# EAGLE design Stacja_Lutownicza_STM (EAGLE 9.2.2)
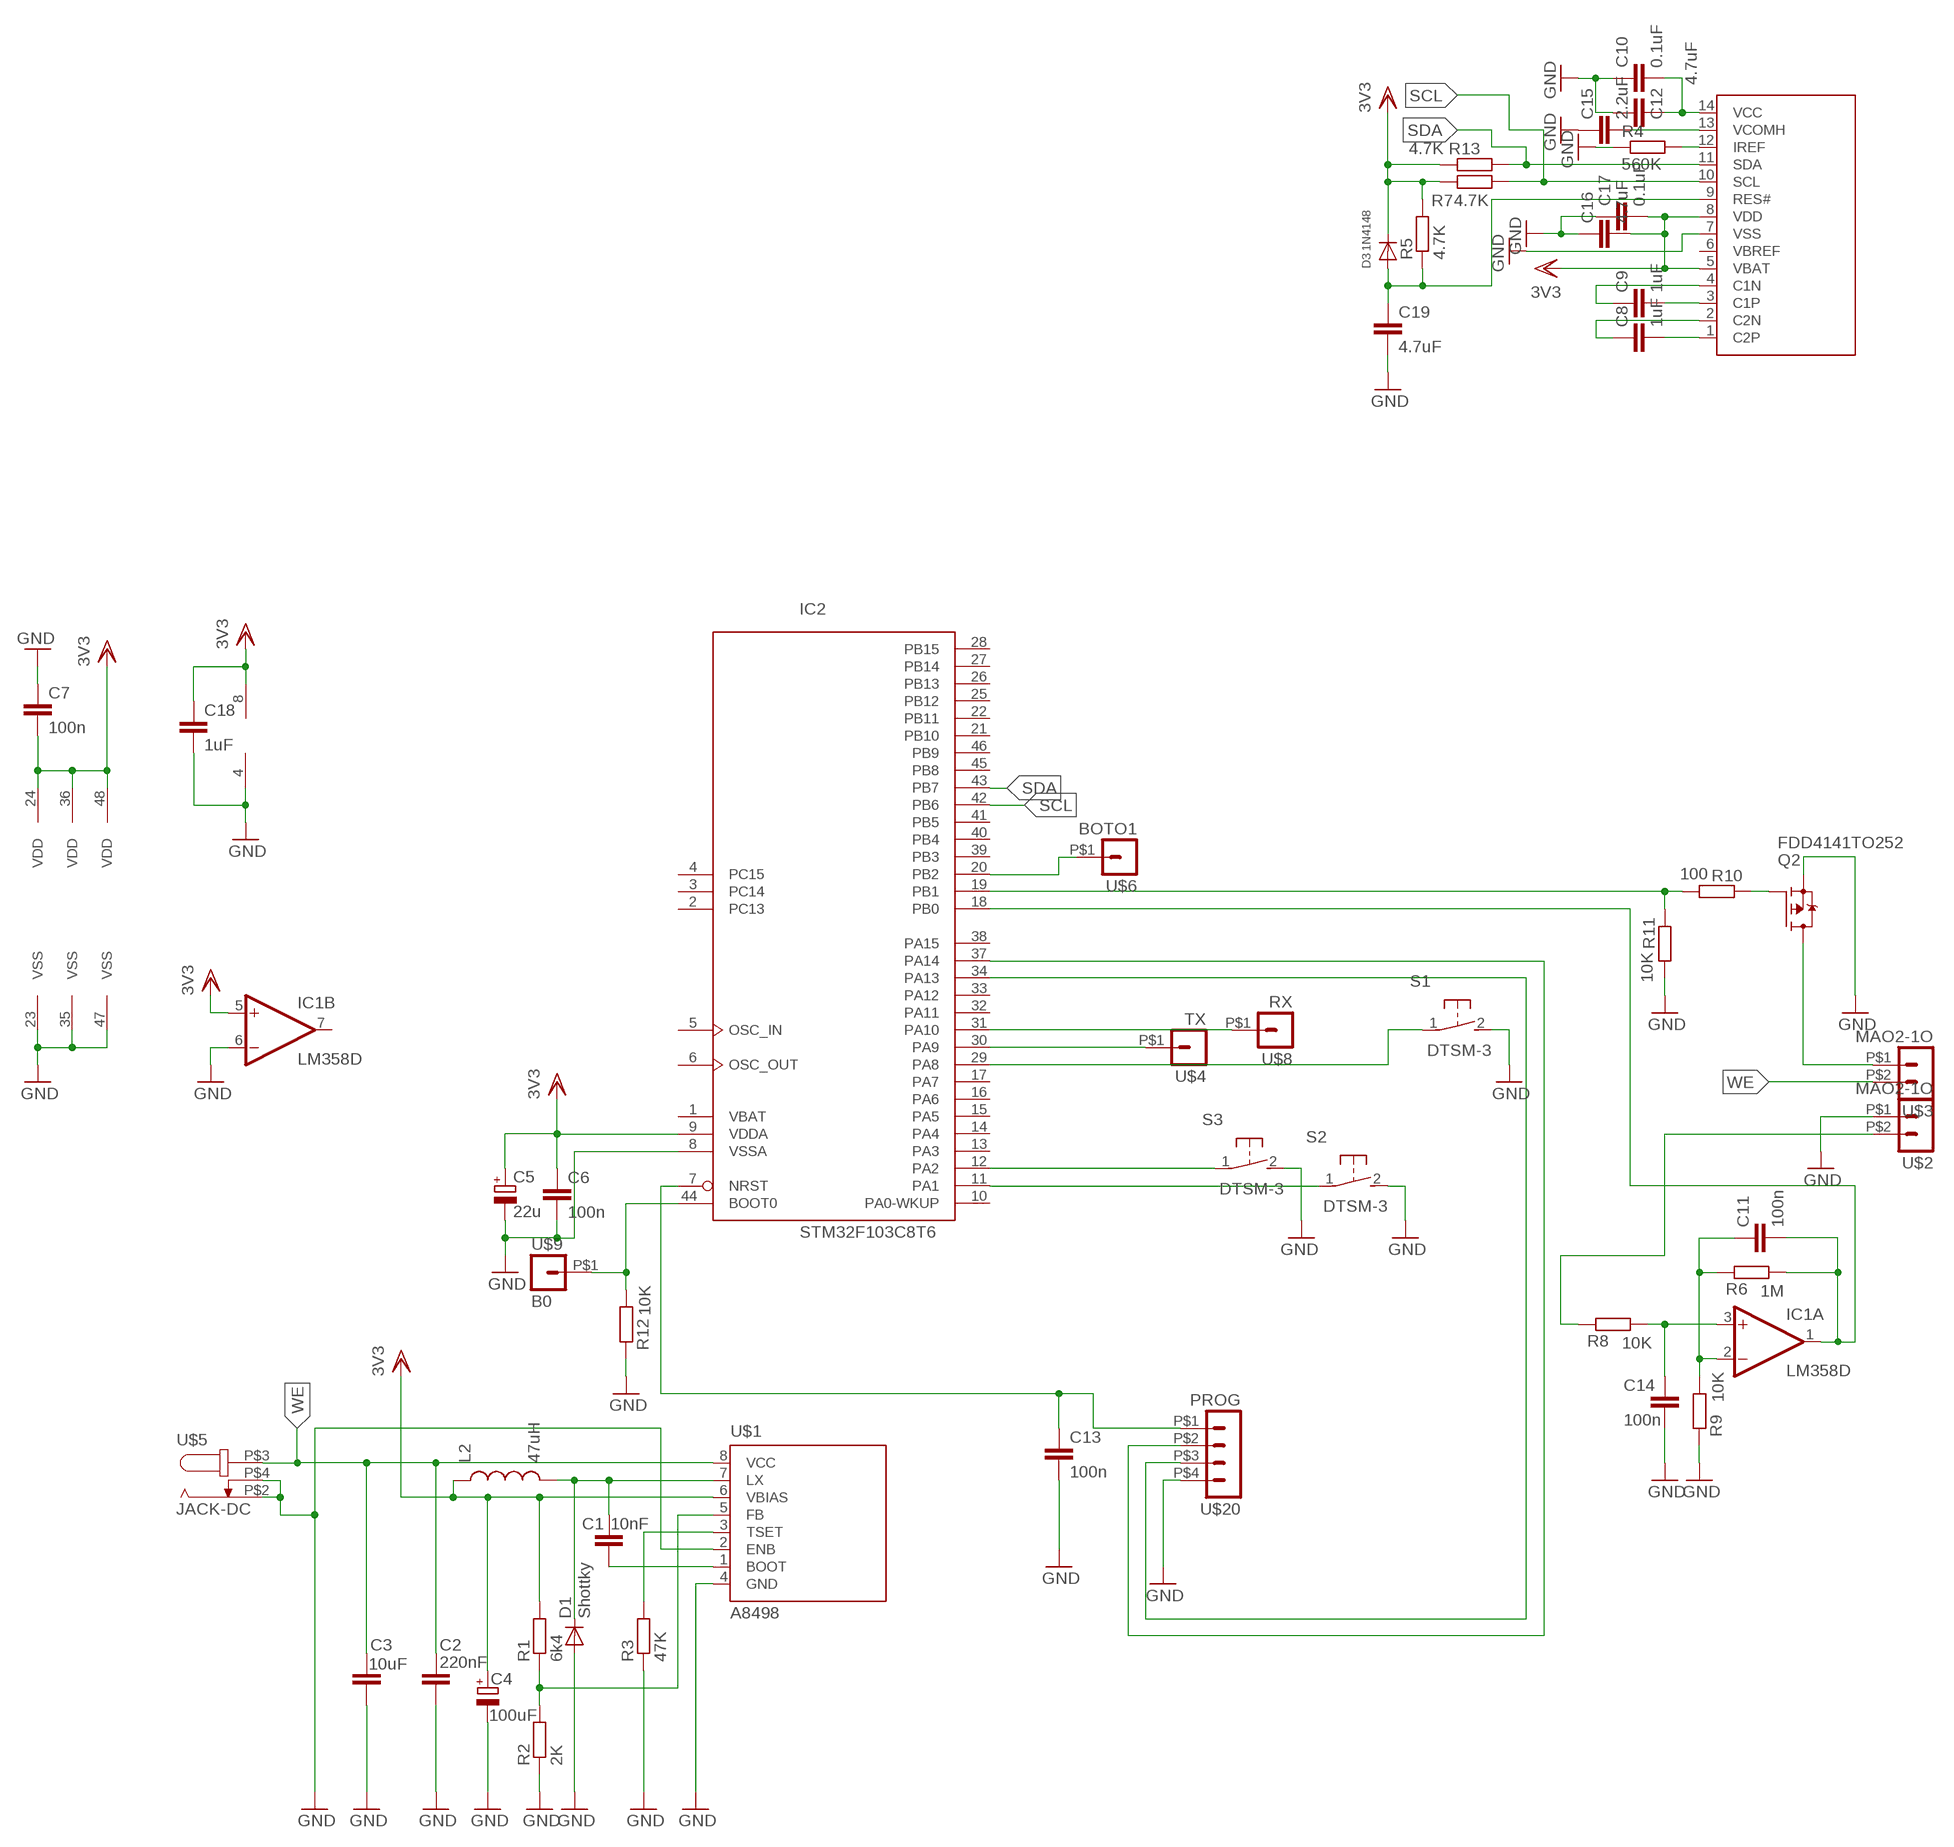
[diagram p0: schematic, sheet 1]

## Parts
C1  10nF  C-EUC1206  [C1206]
C2  220nF  C-EUC1210  [C1210]
C3  10uF  C-EUC0603  [C0603]
C4  100uF  CPOL-EUSMCD  [SMC_D]
C5  22u  CPOL-EUR/2012-12R  [R/2012-12R]
C6  100n  C-EUC0603  [C0603]
C7  100n  C-EUC0603  [C0603]
C8  1uF  C-EUC0603  [C0603]
C9  1uF  C-EUC0603  [C0603]
C10  0.1uF  C-EUC0603  [C0603]
C11  100n  C-EUC0603  [C0603]
C12  4.7uF  C-EUC0603  [C0603]
C13  100n  C-EUC0603  [C0603]
C14  100n  C-EUC0603  [C0603]
C15  2.2uF  C-EUC0603  [C0603]
C16  4.7uF  C-EUC0603  [C0603]
C17  0.1uF  C-EUC0603  [C0603]
C18  1uF  C-EUC0603  [C0603]
C19  4.7uF  C-EUC0603  [C0603]
D1  Shottky  CGRM4003-G  [SOD-123_MINI-SMA]
D3  1N4148  DIODESOD-323F  [SOD-323F]
IC1  LM358D  [SO08]
IC2  STM32F103C8T6  STM32F102C4T  [LQFP48]
L2  47uH  INDUCTOR1206H*  [INDUCTOR-1206]
Q2  FDD4141TO252  [TO252]
R1  6k4  R-EU_R0603  [R0603]
R2  2K  R-EU_R0603  [R0603]
R3  47K  R-EU_R0603  [R0603]
R4  560K  R-EU_R0603  [R0603]
R5  4.7K  R-EU_R0603  [R0603]
R6  1M  R-EU_R0603  [R0603]
R7  4.7K  R-EU_R0603  [R0603]
R8  10K  R-EU_R0603  [R0603]
R9  10K  R-EU_R0603  [R0603]
R10  100  R-EU_R0603  [R0603]
R11  10K  R-EU_R0603  [R0603]
R12  10K  R-EU_R0603  [R0603]
R13  4.7K  R-EU_R0603  [R0603]
S1  DTSM-3  [DTSM-3]
S2  DTSM-3  [DTSM-3]
S3  DTSM-3  [DTSM-3]
U$1  A8498  [SO08]
U$2  MAO2-1O  [MAO2-1O]
U$3  MAO2-1O  [MAO2-1O]
U$4  TX  MAO1-1O  [MAO1-1O]
U$5  JACK-DC  [JACK-DC]
U$6  BOTO1  MAO1-1O  [MAO1-1O]
U$7  OLED_0_91  [OLED_0_91]
U$8  RX  MAO1-1O  [MAO1-1O]
U$9  B0  MAO1-1O  [MAO1-1O]
U$20  PROG  MAO4-$O  [MAO4-4O]

## Nets
GND: C2.2 C3.2 C4.- C5.- C6.2 C7.1 C10.1 C12.1 C13.2 C14.2 C15.1 C16.1 C17.1 C18.2 C19.2 D1.A IC1.4(P:V-) IC1.6(B:-IN) IC2.8(VSSA) IC2.23(VSS) IC2.35(VSS) IC2.47(VSS) Q2.2(S) R2.1 R3.1 R4.1 R9.1 R11.2 R12.1 S1.2 S2.2 S3.2 U$1.2(ENB) U$1.4(GND) U$2.P$1 U$5.P$2 U$5.P$4 U$7.7(VSS) U$20.P$4
N$1: C1.2 D1.C L2.P$2 U$1.7(LX)
N$2: IC2.12(PA2) S3.1
N$3: IC2.29(PA8) S1.1
N$4: C1.1 U$1.1(BOOT)
N$5: IC2.30(PA9) U$4.P$1
N$6: R3.2 U$1.3(TSET)
N$7: R1.1 R2.2 U$1.5(FB)
N$8: IC2.31(PA10) U$8.P$1
N$9: IC2.11(PA1) S2.1
N$10: C11.2 IC1.1(A:OUT) IC2.18(PB0) R6.2
N$11: IC2.44(BOOT0) R12.2 U$9.P$1
N$12: C11.1 IC1.2(A:-IN) R6.1 R9.2
N$13: C14.1 IC1.3(A:+IN) R8.2
N$14: IC2.20(PB2) U$6.P$1
N$16: C8.2 U$7.1(C2P)
N$17: C8.1 U$7.2(C2N)
N$18: C9.2 U$7.3(C1P)
N$19: C9.1 U$7.4(C1N)
N$20: IC2.37(PA14) U$20.P$2
N$21: IC2.34(PA13) U$20.P$3
N$22: C10.2 C12.2 U$7.14(VCC)
N$23: Q2.1(G) R10.1
N$24: R8.1 U$2.P$2
N$25: IC2.19(PB1) R10.2 R11.1
N$26: Q2.3(D) U$3.P$1
N$28: C15.2 U$7.13(VCOMH)
N$29: R4.2 U$7.12(IREF)
N$34: C19.1 D3.A R5.1 U$7.9(RES#)
NRST: C13.1 IC2.7(NRST) U$20.P$1
SCL: IC2.42(PB6) R7.2 U$7.10(SCL)
SDA: IC2.43(PB7) R13.2 U$7.11(SDA)
VDD: C4.+ C5.+ C6.1 C7.2 C16.2 C17.2 C18.1 D3.C IC1.5(B:+IN) IC1.8(P:V+) IC2.9(VDDA) IC2.24(VDD) IC2.36(VDD) IC2.48(VDD) L2.P$1 R1.2 R5.2 R7.1 R13.1 U$1.6(VBIAS) U$7.5(VBAT) U$7.8(VDD) ; supply symbol labelled 3V3
WE: C2.1 C3.1 U$1.8(VCC) U$3.P$2 U$5.P$3
Unconnected: IC1.7(B:OUT) IC2.2(PC13) IC2.3(PC14) IC2.4(PC15) IC2.5(OSC_IN) IC2.6(OSC_OUT) IC2.10(PA0-WKUP) IC2.13(PA3) IC2.14(PA4) IC2.15(PA5) IC2.16(PA6) IC2.17(PA7) IC2.21(PB10) IC2.22(PB11) IC2.25(PB12) IC2.26(PB13) IC2.27(PB14) IC2.28(PB15) IC2.32(PA11) IC2.33(PA12) IC2.38(PA15) IC2.39(PB3) IC2.40(PB4) IC2.41(PB5) IC2.45(PB8) IC2.46(PB9) U$7.6(VBREF)

## Power pins joined to a net without a drawn wire
VBAT: IC2.1(VBAT)

## Library data of the parts
C1-C3 C8-C10 C12 C15-C19 = rcl:C-EU: CAPACITOR, European symbol
C4 = rcl:CPOL-EU: POLARIZED CAPACITOR, European symbol
C5 = resistor:CPOL-EU: POLARIZED CAPACITOR, European symbol
C6 C7 C11 C13 C14 = resistor:C-EU: CAPACITOR, European symbol
D1 = diode:CGRM400*-G: Molded plasitc,JEDEC SOD-123/Mini SMA Source: Comchip CGRM4001-G.pdf
D3 = adafruit:DIODE: Diode SMADIODE - SMA Surface Mount Package 20V 1A Schottky Diode Digikey: 641-1014-6-ND DO-1N4148 - Through Hole Small Current Diode SOD-123 20V 1 A (.5mV Vf) Schottky Diode - Digikey: MBRX120TPMSCT-ND SOD-323 10V 570mA (.38mV Vf, 3ns) Schottky Diode - Digikey: ZLLS410CT-ND SOD-523 30V 30mA Schottky Diode (RB751S-40TE61) - Digikey: RB751S-40TE61CT-ND SOT23-R/W - SOT23 Package (R = Solder Paste/Reflow Ovens, W = Hand-Soldering) BAT54Film 40V 300mA - Digikey: 497-7162-1-ND
IC1 = linear:LM358: OP AMP also LM158; LM258; LM2904 Source: http://cache.national.com/ds/LM/LM158.pdf
IC2 = micro-stm_v3:STM32F102C*T: ARM 32-bit Cortex™-M3 CPU 48 MHz maximum frequency 16 to 128 Kbytes of Flash memory 4 to 16 kbytes of SRAM 37 GPIOs 2.0 to 3.6 V application supply
L2 = SparkFun:INDUCTOR: Inductors Basic Inductor/Choke - 0603 and 1206. Footprints are not proven and vary greatly between part numbers.
Q2 = transistor-fet:FDD4141: P-Channel PowerTrench® MOSFET Source: FDD4141.pdf
R1-R13 = rcl:R-EU_: RESISTOR, European symbol
S1-S3 = switch-tact:DTSM-3
U$1 = GUFIM:A8498
U$2 U$3 = GUFIM:MAO2-1O
U$4 U$6 U$8 U$9 = GUFIM:MAO1-1O
U$5 = GUFIM:JACK-DC
U$7 = GUFIM:OLED_0_91
U$20 = GUFIM:MAO4-$O

## Board
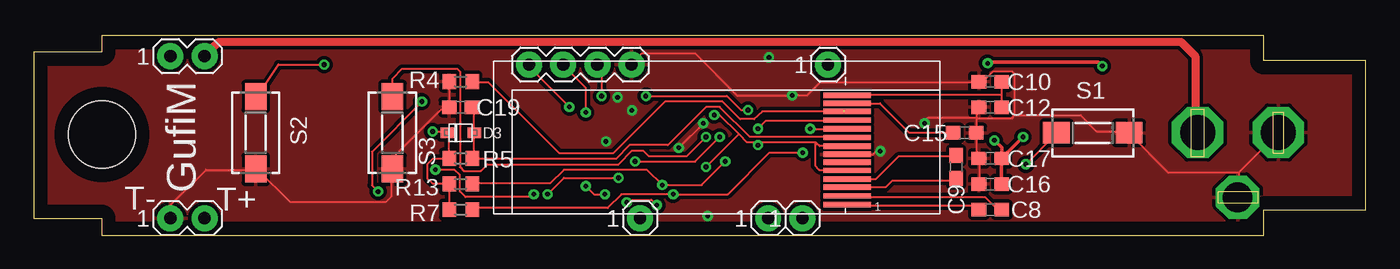
[diagram p1: board, top side]
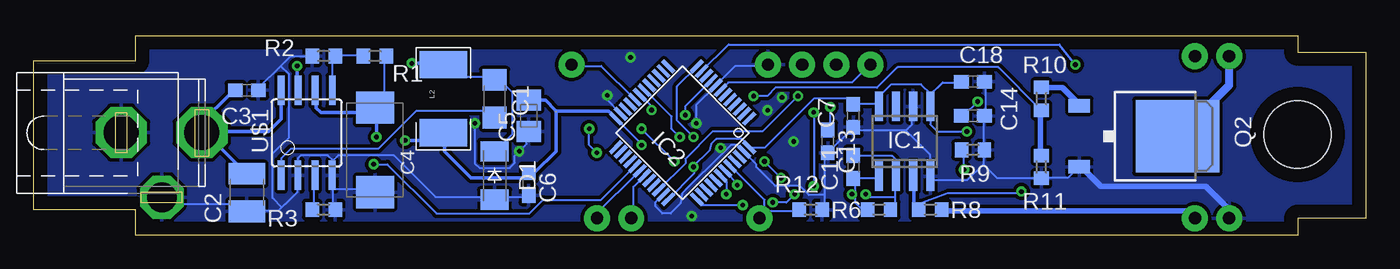
[diagram p2: board, bottom side, seen from below]

Size 99.04 x 14.86 mm. Coordinates in mm from the lower left corner, seen from the top.
Outline: 0,1.27 5.08,1.27 5.08,0 91.44,0 91.44,1.91 99.04,1.91 99.04,13.01 91.44,13.01 91.44,14.86 5.08,14.86 5.08,13.64 0,13.64 0,1.27
Copper layers (1*16): Top 0.035mm / dielectric 1.5mm / Bottom 0.035mm
Design rules "default": minimum track width 6mil, minimum drill 0.35mm, track to track 6mil, track to pad 6mil, pad to pad 6mil, via to via 6mil, smd to smd 6mil, copper to edge 40mil, drill to drill 6mil, minimum pad ring 10mil, minimum via ring 8mil, stop-mask expansion 4mil, vias tented up to drill 0mil, thermal gap 10mil
Holes 5 mm at 5.08,7.49

### Footprints (pad centres in the part's own frame; a part is rotated, then mirrored left to right if it is on the bottom)
C1206 = smd 1.6 x 1.8: 1 -1.4,0; 2 1.4,0
C1210 = smd 1.6 x 2.7: 1 -1.4,0; 2 1.4,0
C0603 = smd 1.1 x 1: 1 -0.85,0; 2 0.85,0
SMC_D = smd 2.4 x 2.8: + -3.15,0; - 3.15,0
R/2012-12R = smd 1.55 x 1.8: + 1.175,0; - -1.175,0
SOD-123_MINI-SMA = smd 1.5 x 2.1: A 1.8,0; C -1.8,0
SOD-323F = smd 1 x 0.8: A -1,0; C 1,0
SO08 = smd 0.6 x 2.2: 1 -1.905,-2.6; 2 -0.635,-2.6; 3 0.635,-2.6; 4 1.905,-2.6; 5 1.905,2.6; 6 0.635,2.6; 7 -0.635,2.6; 8 -1.905,2.6
LQFP48 = smd 0.3 x 1.2: 1 -2.75,-4.25; 2 -2.25,-4.25; 3 -1.75,-4.25; 4 -1.25,-4.25; 5 -0.75,-4.25; 6 -0.25,-4.25; 7 0.25,-4.25; 8 0.75,-4.25; 9 1.25,-4.25; 10 1.75,-4.25; 11 2.25,-4.25; 12 2.75,-4.25; 25 2.75,4.25; 26 2.25,4.25; 27 1.75,4.25; 28 1.25,4.25; 29 0.75,4.25; 30 0.25,4.25; 31 -0.25,4.25; 32 -0.75,4.25; 33 -1.25,4.25; 34 -1.75,4.25; 35 -2.25,4.25; 36 -2.75,4.25 | smd 1.2 x 0.3: 13 4.25,-2.75; 14 4.25,-2.25; 15 4.25,-1.75; 16 4.25,-1.25; 17 4.25,-0.75; 18 4.25,-0.25; 19 4.25,0.25; 20 4.25,0.75; 21 4.25,1.25; 22 4.25,1.75; 23 4.25,2.25; 24 4.25,2.75; 37 -4.25,2.75; 38 -4.25,2.25; 39 -4.25,1.75; 40 -4.25,1.25; 41 -4.25,0.75; 42 -4.25,0.25; 43 -4.25,-0.25; 44 -4.25,-0.75; 45 -4.25,-1.25; 46 -4.25,-1.75; 47 -4.25,-2.25; 48 -4.25,-2.75
INDUCTOR-1206 = smd 2.032 x 3.556: P$1 -2.54,0; P$2 2.54,0
TO252 = smd 1 x 1.6: 1 -2.28,-4.8; 2 2.28,-4.8 | smd 5.4 x 6.2: 3 0,2.5
R0603 = smd 1 x 1.1: 1 -0.85,0; 2 0.85,0
DTSM-3 = smd 2 x 1.6: 1 -2.7,0; 2 2.7,0
SO08' = smd 0.5 x 2.2: 1 -1.905,-3.154; 2 -0.645,-3.154; 3 0.625,-3.154; 4 1.895,-3.154; 5 1.905,3.154; 6 0.635,3.154; 7 -0.635,3.154; 8 -1.905,3.154
MAO2-1O = drill 0.914 pad 1.93: P$1 -1.27,0; P$2 1.27,0
MAO1-1O = drill 0.914 pad 1.93: P$1 0,0
JACK-DC = drill 2.6 pad 3.81 octagon: P$2 2.083,0.025; P$3 8.077,0.025 | drill 2.2 pad 3.048 octagon: P$4 5.105,-4.801
OLED_0_91 = smd 3.5 x 0.4: 1 12.22,-4.71; 2 12.22,-4.06; 3 12.22,-3.41; 4 12.22,-2.81; 5 12.22,-2.16; 6 12.22,-1.56; 7 12.22,-0.96; 8 12.22,-0.36; 9 12.22,0.29; 10 12.22,0.94; 11 12.22,1.59; 12 12.22,2.24; 13 12.22,2.84; 14 12.22,3.44
MAO4-4O = drill 0.914 pad 1.93: P$1 -3.81,0; P$2 -1.27,0; P$3 1.27,0; P$4 3.81,0

### Placement (x,y rotation side)
C1  64.77,10.16 90 bottom
C2  83.19,3.17 270 bottom
C3  83.19,10.79 0 bottom
C4  73.66,6.35 270 bottom
C5  62.23,8.89 90 bottom
C6  62.23,3.81 270 bottom
C7  38.1,8.89 90 bottom
C8  71.12,1.91 180 top
C9  68.58,5.08 270 top
C10  71.12,11.43 0 top
C11  38.1,5.08 270 bottom
C12  71.12,9.53 0 top
C13  40.01,6.99 270 bottom
C14  29.21,8.89 0 bottom
C15  69.22,7.62 180 top
C16  71.12,3.81 0 top
C17  71.12,5.71 0 top
C18  29.21,11.43 0 bottom
C19  31.75,9.53 180 top
D1  64.77,4.45 270 bottom
D3  31.75,7.62 180 top
IC1  34.29,6.99 0 bottom
IC2  50.8,7.62 135 bottom
L2  68.58,10.16 90 bottom
Q2  16.51,7.37 270 bottom
R1  73.66,13.34 0 bottom
R2  77.47,13.34 0 bottom
R3  77.47,1.91 180 bottom
R4  31.75,11.43 0 top
R5  31.75,5.71 180 top
R6  36.2,1.91 180 bottom
R7  31.75,1.91 0 top
R8  32.38,1.91 180 bottom
R9  29.21,6.35 180 bottom
R10  24.13,10.16 270 bottom
R11  24.13,5.08 270 bottom
R12  41.27,1.91 180 bottom
R13  31.75,3.81 0 top
S1  78.74,7.62 0 top
S2  16.51,7.62 270 top
S3  26.67,7.62 270 top
U$1  A8498  [SO08']  78.74,7.62 0 bottom
U$2  11.43,1.27 0 top
U$3  11.43,13.34 0 top
U$4  57.15,1.27 0 top
U$5  94.61,7.62 0 bottom
U$6  59.05,12.7 0 top
U$7  48.26,6.99 0 top
U$8  54.61,1.27 0 top
U$9  45.09,1.27 0 top
U$20  40.64,12.7 0 top

### Tracks (layer width: path | path; a pad name or v marks a point on that pad's centre or on a via)
GND  (via drill 0.35)
  Top 0.152: R4.1 30.89,11.38 30.89,9.55 C19.2 30.89,9.35 30.28,9.35 26.82,5.89 26.82,5.08 S3.2 26.62,4.88 26.62,2.9 26.19,2.46 19.07,2.46 16.66,4.88 S2.2 16.46,4.88 12.83,4.88 10.16,2.21 U$2.P$1 | 89.61,4.67 89.61,2.85 U$5.P$4 | 89.61,4.67 92.46,7.52 U$5.P$2 | U$20.P$4 44.5,12.8 45.24,13.54 49.15,13.54 52.27,10.41 v56.39,10.41 57.48,10.41 58.45,11.38 70.1,11.38 C10.1 70.31,11.58 70.71,11.58 71.32,12.19 72.75,12.19 72.95,11.99 72.95,8.94 | v62.94,6.25 62.64,6.25 62.41,6.02 U$7.7 | C16.1 70.31,3.86 70.31,5.69 C17.1 70.1,5.89 70.1,7.52 C15.1 70.1,7.72 70.1,8.74 | 70.1,8.74 70.1,9.35 C12.1 | 72.95,8.94 72.75,8.74 70.1,8.74 | 72.95,8.94 77.8,8.94 79.02,7.72 81.28,7.72 S1.2 81.48,7.52 84.33,4.67 89.61,4.67 | v66.24,8.33 66.24,8.53 66.45,8.74 70.1,8.74 | v49.78,8.33 v47.95,6.5
  Bottom 0.152: C18.2 28.25,11.38 28.25,8.94 C14.2 28.45,8.74 28.45,6.5 R9.1 28.45,6.3 28.45,5.28 | 28.45,5.28 29.64,4.09 32.19,4.09 IC1.4 32.41,4.4 32.41,5.99 34.2,7.79 | 28.45,5.28 27.43,4.27 24.18,4.27 R11.2 23.98,4.27 22.15,4.27 21.34,5.08 Q2.2 21.13,5.08 | 40.23,3 40.23,5.89 40.03,6.1 C13.2 39.83,6.3 38.2,7.92 C7.1 37.88,7.82 34.24,7.82 34.2,7.79 | 40.23,3 40.23,2.03 R12.1 | 40.23,3 41.4,3 42.06,3.66 43.89,3.66 45.31,5.08 45.31,5.28 46.13,6.1 IC2.47 46.33,6.3 46.76,6.73 47.19,6.73 47.59,6.34 | IC2.35 52.25,3.02 52.81,2.46 52.81,2.13 52.3,1.63 51.69,1.63 50.95,2.36 50.83,3.12 47.59,6.34 | 34.2,7.79 33.73,8.26 33.73,9.55 IC1.6 | 80.67,12.6 79.96,13.31 78.34,13.31 R2.1 | 80.67,12.6 82.3,10.97 C3.2 | C6.2 62.38,2.85 64.62,2.85 D1.A 64.82,2.85 69.16,2.85 72.29,5.97 76.38,5.97 76.78,5.56 | 76.81,3.45 76.81,4.27 U$1.4 | 76.81,3.45 76.81,2.03 R3.1 | 76.78,5.56 77.17,5.94 79.17,5.94 79.4,5.71 79.4,4.48 U$1.2 79.45,4.27 79.45,3.2 80.34,2.31 80.35,2.32 80.59,2.08 | 77.01,5.08 77.01,4.47 U$1.4 | 77.01,5.08 77.01,5.18 76.73,5.46 76.81,5.54 76.78,5.56 | 77.01,5.08 U$1.4 | 80.59,2.08 80.85,1.83 83.11,1.83 C2.2 83.31,1.83 83.77,2.29 89.2,2.29 U$5.P$4 | 76.81,3.45 74.17,3.45 C4.- | 80.67,12.6 80.06,11.99 80.06,7.29 81.28,6.07 81.28,2.77 80.59,2.08 | v56.39,10.41 56.39,10.06 55.47,9.14 IC2.23 | U$20.P$4 44.5,12.6 46.89,12.6 IC2.8 48.33,11.13 49.78,9.68 v49.78,8.33 | C5.- 62.38,7.52 62.38,6.81 v62.94,6.25 63.27,5.92 63.27,5.38 63.65,5 65.89,5 66.24,5.36 v66.24,8.33 | v47.95,6.5 47.75,6.5 47.59,6.34
  Bottom 0.406: U$2.P$1 10.16,1.88 11.91,3.63 19.68,3.63 21.13,5.08
  other vias: 42.55,6.99 43.41,10.26 44.48,9.3 50.11,1.42 54.66,13.23
  pour Top (isolate 0.254): 0,0 99.06,0 99.06,15.24 0,15.24
  pour Bottom (isolate 0.254): 0,0 99.06,0 99.06,15.24 0,15.24
N$1  (via drill 0.35)
  Top 0.254: v70.92,12.8 71.02,12.9 79.15,12.9 v79.45,12.6
  Bottom 0.152: D1.C 64.62,6.3 64.62,6.35 63.48,7.49 63.48,10.67 64.37,11.56 C1.2 65.34,11.81 67.69,11.81 L2.P$2 68.68,12.8 | 79.45,10.97 U$1.7
  Bottom 0.254: v79.45,12.6 79.45,10.97 | 68.68,12.8 v70.92,12.8
N$2  (via drill 0.35)
  Top 0.152: v49.99,7.32 48.56,5.89 45.72,5.89 45.31,6.3 44.5,6.3 43.48,5.28 33.73,5.28 33.25,4.8 31.98,4.8 31.7,5.08 31.7,12.19 31.5,12.39 27.41,12.39 26.67,11.66 S3.1
  Bottom 0.152: v49.99,7.32 51.21,8.53 51.21,11.1 IC2.12
N$3  (via drill 0.35)
  Top 0.152: v73.76,5.28 76,7.52 S1.1
  Bottom 0.152: v73.76,5.28 72.75,5.28 69.09,1.63 62.18,1.63 61.16,2.64 56.84,2.64 54.35,5.14 IC2.29
N$4
  Bottom 0.152: C1.1 64.91,9.27 70.59,9.27 73.41,6.45 79.91,6.45 80.62,5.74 80.62,4.47 U$1.1
N$5
  Bottom 0.152: IC2.30 54.01,4.79 57.34,1.46 U$4.P$1
N$6
  Bottom 0.152: R3.2 78.23,2.03 78.23,4.27 U$1.3
N$7
  Bottom 0.152: R1.1 74.57,13.41 76.61,13.41 R2.2 76.81,13.21 76.81,10.97 U$1.5
N$8
  Bottom 0.152: IC2.31 54.46,3.61 54.46,1.42 U$8.P$1
N$9  (via drill 0.35)
  Top 0.152: S2.1 16.66,10.36 18.21,12.7 v21.59,12.7
  Bottom 0.152: IC2.11 49.38,12.22 47.37,14.2 22.78,14.2 v21.59,12.7
N$10  (via drill 0.35)
  Top 0.152: v51,7.32 49.17,5.49 v44.7,5.49 | v43.48,4.27 39.42,4.27 v38.2,3.05
  Bottom 0.152: 38,3.05 38,4.06 C11.2 38,4.27 36.37,4.27 IC1.1 | 38,3.05 38,2.43 37.41,1.91 R6.2 | v51,7.32 51.61,7.92 51.61,8.84 53.52,10.74 53.58,10.76 IC2.18 | v43.48,4.27 v44.7,5.49 | 38,3.05 v38.2,3.05
N$11
  Bottom 0.152: 44.7,1.63 44.91,1.42 U$9.P$1 44.7,1.63 | 44.7,1.63 44.5,1.83 42.27,1.83 R12.2 | 44.7,1.63 44.7,2.64 47.14,5.08 IC2.44
N$12  (via drill 0.35)
  Top 0.152: v29.87,4.88 31.29,4.88 31.7,4.47 31.7,3.25 32.11,2.85 36.98,2.85 v37.19,3.05
  Bottom 0.152: 35,2.87 35,4.22 34.95,4.27 IC1.2 34.95,4.47 34.95,5.64 35.2,5.89 38,5.89 C11.1 | 35,2.87 35,2.13 R6.1 | v29.87,4.88 29.87,6.3 R9.2 | v37.19,3.05 37.01,2.87 35,2.87
N$13  (via drill 0.35)
  Top 0.152: v28.85,9.96 28.85,9.91 25.15,6.2 25.15,3.71 v25.6,3.25
  Bottom 0.152: v28.85,9.96 29.87,8.94 C14.1 | v25.6,3.25 25.7,3.15 31.06,3.15 33.25,2.34 R8.2 33.33,2.03 33.6,2.31 | 33.6,4.34 IC1.3
  Bottom 0.254: 33.6,2.31 33.6,4.34
N$14
  Bottom 0.152: IC2.20 54.35,10.1 56.84,12.6 58.93,12.6 U$6.P$1
N$16
  Top 0.152: C8.2 69.84,2.23 60.55,2.23 U$7.1
N$17
  Top 0.152: C8.1 71.93,2.03 71.53,2.03 70.71,2.85 60.55,2.85 U$7.2
N$18
  Top 0.152: C9.2 68.48,4.06 63.83,4.06 63.35,3.58 U$7.3
N$19
  Top 0.152: C9.1 68.48,5.89 64.34,5.89 62.64,4.19 60.49,4.19 U$7.4
N$20  (via drill 0.35)
  Top 0.152: v46.33,2.23 45.92,2.64 44.3,2.64 v44.09,2.44 | v42.47,3.05 41.66,3.05 v41.05,3.66 | v41.05,9.14 41.05,10.97 39.42,12.6 U$20.P$2
  Bottom 0.152: v46.33,2.23 49.3,2.23 IC2.37 | v44.09,2.44 43.08,2.44 v42.47,3.05 | v41.05,9.14 v41.05,3.66
N$21  (via drill 0.35)
  Top 0.152: v42.22,10.36 42.22,12.45 42.06,12.6 U$20.P$3
  Bottom 0.152: v42.22,10.36 44.86,7.72 48.56,7.72 50.6,5.69 50.6,5.33 52.54,3.39 IC2.34
N$22
  Top 0.152: 71.93,10.46 71.93,11.38 C10.2 | 71.93,10.46 71.93,9.55 C12.2 | 71.93,10.46 60.5,10.46 U$7.14
N$23
  Bottom 0.152: 23.98,10.97 R10.1 | 21.34,9.75 Q2.1
  Bottom 0.406: 23.98,10.97 22.55,10.97 21.34,9.75
N$24
  Bottom 0.152: 31.5,1.83 R8.1
  Bottom 0.406: 31.5,1.83 13.21,1.83 12.8,1.42 U$2.P$2
N$25  (via drill 0.35)
  Top 0.152: v53.11,9.32 52.58,9.32 51.54,10.36 v45.52,10.36
  Bottom 0.152: 24.18,6.1 R11.1 | 24.18,9.14 R10.2 24.18,9.35 27.33,12.5 34.82,12.5 36.35,10.97 43.89,10.97 44.5,10.36 v45.52,10.36 | v53.11,9.32 53.11,9.63 53.85,10.36 IC2.19
  Bottom 0.406: 24.18,9.14 24.18,6.1
N$26
  Bottom 0.152: 13.97,7.37 Q2.3
  Bottom 0.61: U$3.P$1 10.16,11.18 13.97,7.37
N$28
  Top 0.152: C15.2 68.34,7.64 65.08,7.64 62.92,9.8 60.5,9.8 U$7.13
N$29
  Top 0.152: R4.2 32.72,11.38 33.81,11.38 39.09,6.1 43.08,6.1 46.94,9.96 51.21,9.96 52.53,8.64 53.57,8.64 54.18,9.22 U$7.12
N$34
  Top 0.152: C19.1 32.72,9.35 32.72,7.72 D3.A 32.72,7.52 32.72,5.89 R5.1 32.72,5.69 43.28,5.69 44.3,6.71 47.14,6.71 49.99,9.55 51,9.55 53.24,7.32 60.35,7.32 U$7.9
NRST  (via drill 0.35)
  Top 0.152: v39.83,9.55 36.78,12.6 U$20.P$1
  Bottom 0.152: v39.83,9.55 39.83,7.92 C13.1 | IC2.7 47.4,11.38 38.2,11.38 36.98,12.6 U$20.P$1
SCL  (via drill 0.35)
  Top 0.152: R7.2 32.72,2.03 42.67,2.03 43.69,3.05 v47.55,3.05 51.61,3.05 54.71,6.15 v57.17,6.15 | v57.73,7.92 60.35,7.92 U$7.10
  Bottom 0.152: v47.55,3.05 47.55,3.99 47.97,4.41 IC2.42 | v57.73,7.92 57.73,6.71 v57.17,6.15
SDA  (via drill 0.35)
  Top 0.152: R13.2 32.72,3.86 38.41,3.86 39.42,4.88 45.59,4.88 v46.74,3.73 49.66,3.73 v51.41,5.49 | v53.85,7.92 54.46,8.53 60.35,8.53 U$7.11
  Bottom 0.152: v46.74,3.73 46.74,3.86 47.55,4.67 IC2.43 | v51.41,5.49 v53.85,7.92
VDD  (via drill 0.35)  (1 unrouted)
  Top 0.152: R7.1 30.89,2.03 30.89,3.66 R13.1 30.89,3.86 29.64,3.86 29.26,4.24 29.26,5.28 29.67,5.69 30.89,5.69 R5.2 30.89,5.89 30.89,7.52 D3.C 30.68,7.72 v29.67,7.72 | v50.6,8.94 51,8.94 52.43,7.52 | 52.43,7.52 53.03,6.91 53.85,6.91 | 58.24,6.81 58.09,6.81 58.09,5.18 58.4,4.88 60.35,4.88 U$7.5 | 53.85,6.91 58.14,6.91 58.24,6.81 | 58.24,6.81 58.42,6.63 U$7.8 | 71.93,3.86 C16.2 | 71.93,5.69 C17.2 72.14,5.89 | v53.85,6.71 53.85,6.91 | 52.43,7.52 v49.99,5.08
  Top 0.254: 71.93,5.69 71.93,3.86 | v73.56,7.32 72.14,5.89 | v71.42,7.06 71.97,6.52 C17.2
  Bottom 0.152: IC2.36 49.95,4.58 49.95,5.04 v49.99,5.08 50.01,5.11 48.79,6.33 48.67,6.81 48.31,7.16 46.38,7.16 45.92,6.71 IC2.48 45.72,6.5 44.7,6.5 41.05,10.16 38.61,10.16 38.2,9.75 C7.2 38,9.75 36.37,9.75 IC1.8 36.17,9.75 36.17,10.36 35.31,11.23 33.07,11.23 32.33,10.49 31.45,11.38 | 31.45,11.38 31.47,11.38 32.11,10.74 32.38,10.38 IC1.5 32.38,8.26 31.85,7.72 v29.67,7.72 | 31.45,11.38 30.07,11.38 C18.1 | IC2.9 50.6,9.6 v50.6,8.94 | R1.2 72.95,13.21 72.95,10.16 73.56,9.55 C4.+ | 73.56,9.35 C4.+ | 78.03,10.77 U$1.6 | 73.91,9.12 C4.+ | 61.79,4.66 C6.1 62.62,4.27 | 60.22,9.25 60.22,9.3 | 68.48,7.11 68.48,7.52 L2.P$1 68.48,7.11 | 68.48,7.11 68.53,7.06 | v53.85,6.71 53.85,6.78 IC2.24
  Bottom 0.254: 73.56,9.35 v73.56,7.32 | 78.03,10.77 78.03,9.47 77.67,9.12 73.91,9.12 | 61.79,4.66 60.2,6.25 60.2,9.22 | C5.+ 60.99,10.06 60.22,9.3 | 60.22,9.25 56.3,9.25 IC2.24 | 68.48,7.11 68.48,6.22 66.52,4.27 62.62,4.27 | 68.53,7.06 v71.42,7.06
WE
  Top 0.61: U$3.P$2 13.77,14.4 85.29,14.4 86.36,13.34 86.36,7.82 U$5.P$3
  Bottom 0.152: 84.12,10.82 84.12,10.77 C3.1 | 86.79,8.15 86.36,7.72 U$5.P$3 | 83.31,4.67 C2.1
  Bottom 0.254: 86.79,8.15 84.12,10.82 | U$1.8 80.64,8.66 81.58,7.72 86.36,7.72 83.31,4.67

### Text on the board
tNames: GufiM | T- | T+